# EAGLE schematic Bluetooth UEXT (EAGLE 9.5.1)
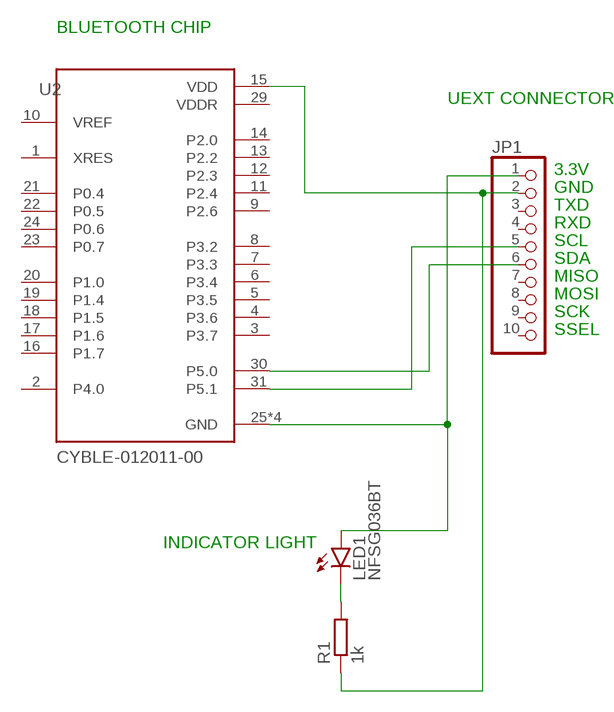
[diagram p0: schematic, sheet 1]

## Parts
JP1  PINHD-1X10/90  [1X10/90]
LED1  NFSG036BT  [NFSG036BT]
R1  1k  R-EU_M1206  [M1206]
U2  CYBLE-012011-00  [XCVR_CYBLE-012011-00]

## Nets
N$1: JP1.1 LED1.A U2.25(GND) U2.26(GND) U2.27(GND) U2.28(GND)
N$3: JP1.6 U2.30(P5.0)
N$4: JP1.5 U2.31(P5.1)
N$5: JP1.2 R1.1 U2.15(VDD)
N$7: LED1.C R1.2
Unconnected: JP1.3 JP1.4 JP1.7 JP1.8 JP1.9 JP1.10 U2.1(XRES) U2.2(P4.0) U2.3(P3.7) U2.4(P3.6) U2.5(P3.5) U2.6(P3.4) U2.7(P3.3) U2.8(P3.2) U2.9(P2.6) U2.10(VREF) U2.11(P2.4) U2.12(P2.3) U2.13(P2.2) U2.14(P2.0) U2.16(P1.7) U2.17(P1.6) U2.18(P1.5) U2.19(P1.4) U2.20(P1.0) U2.21(P0.4) U2.22(P0.5) U2.23(P0.7) U2.24(P0.6)

## Notes on the sheet
- BLUETOOTH CHIP
- UEXT CONNECTOR
- 3.3V
- GND
- TXD
- RXD
- SCL
- SDA
- MISO
- MOSI
- SCK
- SSEL
- INDICATOR LIGHT

## Power pins joined to a net without a drawn wire
VDDR: U2.29(VDDR)

## Library data of the parts
JP1 = pinhead:PINHD-1X10: PIN HEADER
LED1 = led:NFSG036BT: CHIP TYPE GREEN LED NFSx036xT Source: NICHIA CORPORATION .. NFSG036BT-E.pdf
R1 = rcl:R-EU_: RESISTOR, European symbol; SPICEPREFIX: R
U2 = CYBLE-012011-00:CYBLE-012011-00: Bluetooth Bluetooth v4.1 Transceiver Module 2.4GHz ~ 2.48GHz Integrated, Trace Surface Mount; AVAILABILITY: Unavailable; DESCRIPTION: Bluetooth Bluetooth v4.1 Transceiver Module 2.4GHz ~ 2.48GHz Integrated, Trace Surface Mount; MF: Cypress Semiconductor; MP: CYBLE-012011-00; PACKAGE: Module Cypress Semiconductor; PRICE: None